# Altium schematic sheet main.SchDoc
size A2
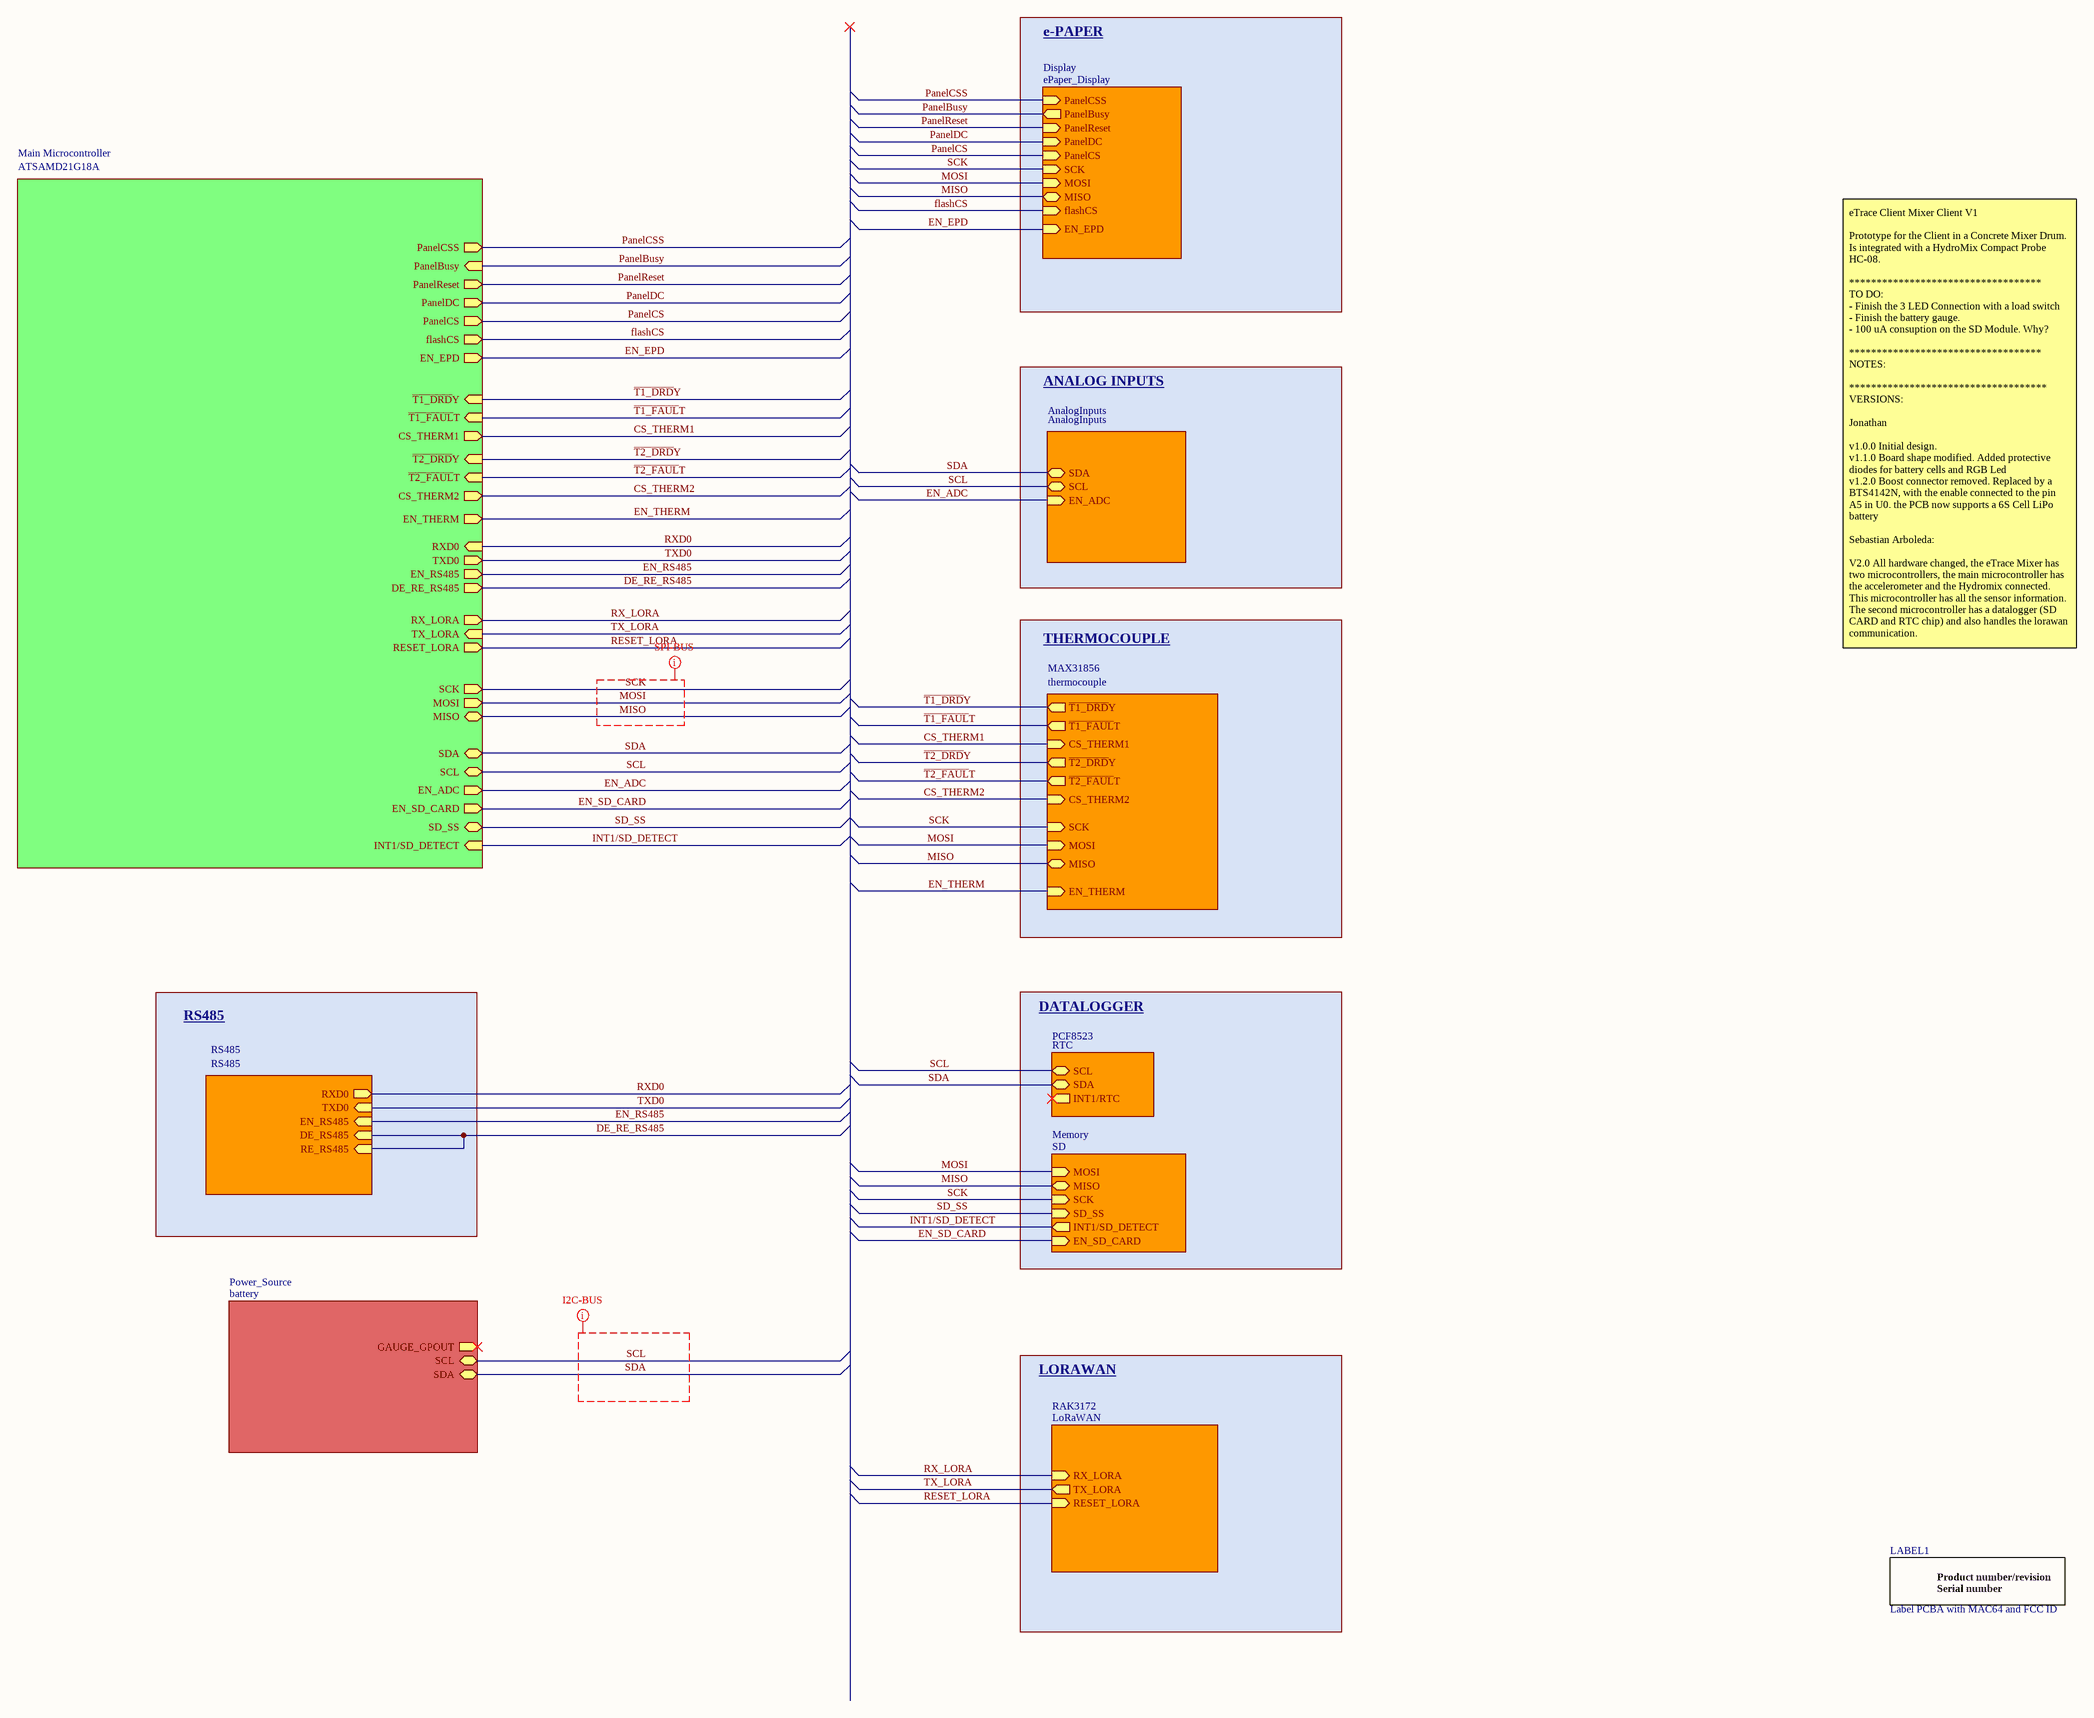
[diagram p0: main.SchDoc]

## Parts
LABEL1  value Label PCBA with MAC64 and FCC ID  [AP8-00317]  (hidden comment: PCBA_LABEL)

## Sub-sheets
AnalogInputs = AnalogInputs: SDA (bidir), SCL (bidir), EN_ADC (in)
Display = ePaper_Display: MOSI (in), EN_EPD (in), PanelBusy (out), MISO (bidir), flashCS (in), PanelDC (in), PanelReset (in), PanelCSS (in), SCK (in), PanelCS (in)
Main Microcontroller = ATSAMD21G18A: TXD0 (out), RXD0 (in), SDA (bidir), SCL (bidir), EN_ADC (out), SD_SS (bidir), flashCS (out), SCK (out), MISO (bidir), PanelCS (out), MOSI (out), EN_SD_CARD (out), PanelDC (out), PanelReset (out), PanelBusy (in), PanelCSS (out), EN_EPD (out), ~{T1_FAUL}T (in), CS_THERM1 (out), ~{T2_DRD}Y (in), CS_THERM2 (out), ~{T2_FAUL}T (in), ~{T1_DRD}Y (in), EN_THERM (out), EN_RS485 (out), DE_RE_RS485 (out), RX_LORA (out), TX_LORA (in), RESET_LORA (out), INT1/SD_DETECT (in)
MAX31856 = thermocouple: MISO (bidir), ~{T1_DRD}Y (out), EN_THERM (in), ~{T2_DRD}Y (out), MOSI (in), CS_THERM1 (in), ~{T2_FAUL}T (out), SCK (in), ~{T1_FAUL}T (out), CS_THERM2 (in)
Memory = SD: MOSI (in), INT1/SD_DETECT (out), SD_SS (in), MISO (bidir), SCK (in), EN_SD_CARD (in)
PCF8523 = RTC: SCL (bidir), SDA (bidir), INT1/RTC (out)
Power_Source = battery: GAUGE_GPOUT (out), SCL (bidir), SDA (bidir)
RAK3172 = LoRaWAN: RX_LORA (in), TX_LORA (out), RESET_LORA (in)
RS485 = RS485: TXD0 (in), EN_RS485 (in), DE_RS485 (in), RXD0 (out), RE_RS485 (in)

## Nets
~{T1_DRD}Y: sheet Main Microcontroller/~{T1_DRD}Y, sheet MAX31856/~{T1_DRD}Y
~{T1_FAUL}T: sheet Main Microcontroller/~{T1_FAUL}T, sheet MAX31856/~{T1_FAUL}T
~{T2_DRD}Y: sheet Main Microcontroller/~{T2_DRD}Y, sheet MAX31856/~{T2_DRD}Y
~{T2_FAUL}T: sheet Main Microcontroller/~{T2_FAUL}T, sheet MAX31856/~{T2_FAUL}T
CS_THERM1: sheet Main Microcontroller/CS_THERM1, sheet MAX31856/CS_THERM1
CS_THERM2: sheet Main Microcontroller/CS_THERM2, sheet MAX31856/CS_THERM2
DE_RE_RS485: sheet Main Microcontroller/DE_RE_RS485, sheet RS485/DE_RS485, sheet RS485/RE_RS485
EN_ADC: sheet Main Microcontroller/EN_ADC, sheet AnalogInputs/EN_ADC
EN_EPD: sheet Main Microcontroller/EN_EPD, sheet Display/EN_EPD
EN_RS485: sheet Main Microcontroller/EN_RS485, sheet RS485/EN_RS485
EN_SD_CARD: sheet Main Microcontroller/EN_SD_CARD, sheet Memory/EN_SD_CARD
EN_THERM: sheet Main Microcontroller/EN_THERM, sheet MAX31856/EN_THERM
flashCS: sheet Main Microcontroller/flashCS, sheet Display/flashCS
INT1/SD_DETECT: sheet Main Microcontroller/INT1/SD_DETECT, sheet Memory/INT1/SD_DETECT
MISO: sheet Main Microcontroller/MISO, sheet MAX31856/MISO, sheet Memory/MISO, sheet Display/MISO
MOSI: sheet Main Microcontroller/MOSI, sheet MAX31856/MOSI, sheet Memory/MOSI, sheet Display/MOSI
PanelBusy: sheet Main Microcontroller/PanelBusy, sheet Display/PanelBusy
PanelCS: sheet Main Microcontroller/PanelCS, sheet Display/PanelCS
PanelCSS: sheet Main Microcontroller/PanelCSS, sheet Display/PanelCSS
PanelDC: sheet Main Microcontroller/PanelDC, sheet Display/PanelDC
PanelReset: sheet Main Microcontroller/PanelReset, sheet Display/PanelReset
RESET_LORA: sheet Main Microcontroller/RESET_LORA, sheet RAK3172/RESET_LORA
RX_LORA: sheet Main Microcontroller/RX_LORA, sheet RAK3172/RX_LORA
RXD0: sheet Main Microcontroller/RXD0, sheet RS485/RXD0
SCK: sheet Main Microcontroller/SCK, sheet MAX31856/SCK, sheet Memory/SCK, sheet Display/SCK
SCL: sheet Power_Source/SCL, sheet Main Microcontroller/SCL, sheet AnalogInputs/SCL, sheet PCF8523/SCL
SD_SS: sheet Main Microcontroller/SD_SS, sheet Memory/SD_SS
SDA: sheet Power_Source/SDA, sheet Main Microcontroller/SDA, sheet AnalogInputs/SDA, sheet PCF8523/SDA
TX_LORA: sheet Main Microcontroller/TX_LORA, sheet RAK3172/TX_LORA
TXD0: sheet Main Microcontroller/TXD0, sheet RS485/TXD0

## Layout directives
net class I2C-BUS: SCL, SDA
net class SPI-BUS: MISO, MOSI, SCK

## Notes on the sheet
- e-PAPER
- ANALOG INPUTS
- THERMOCOUPLE
- eTrace Client Mixer Client V1
  Prototype for the Client in a Concrete Mixer Drum.
  Is integrated with a HydroMix Compact Probe HC-08.
  ***********************************
  TO DO:
  - Finish the 3 LED Connection with a load switch
  - Finish the battery gauge.
  - 100 uA consuption on the SD Module. Why?
  ***********************************
  NOTES:
  ************************************
  VERSIONS:
  Jonathan
  v1.0.0 Initial design.
  v1.1.0 Board shape modified. Added protective diodes for battery cells and RGB Led
  v1.2.0 Boost connector removed. Replaced by a BTS4142N, with the enable connected to the pin A5 in U0. the PCB now supports a 6S Cell LiPo battery
  Sebastian Arboleda:
  V2.0 All hardware changed, the eTrace Mixer has two microcontrollers, the main microcontroller has  the accelerometer and the Hydromix connected. This microcontroller has all the sensor information. The second microcontroller has a datalogger (SD CARD and RTC chip) and also handles the lorawan communication.
- RS485
- DATALOGGER
- LORAWAN
- (in symbol PCBA_LABEL) / Product number/revision / Serial number

## Library data of the parts
LABEL1 = PCBA_LABEL: Label for use on wireless PCBA that needs 64 bit MAC and FCC ID; PartGroup: Mechanical devices,Packaging materials,Printed Labels; Manufacturer: ACT Logimark AS; AN: A09-0847; ComponentStatus: 'Active (verified)'; FootprintStatus: 'Active (Verified)'